# EAGLE design IOMOD-MCP23008-v1_0 (EAGLE 9.7.0)
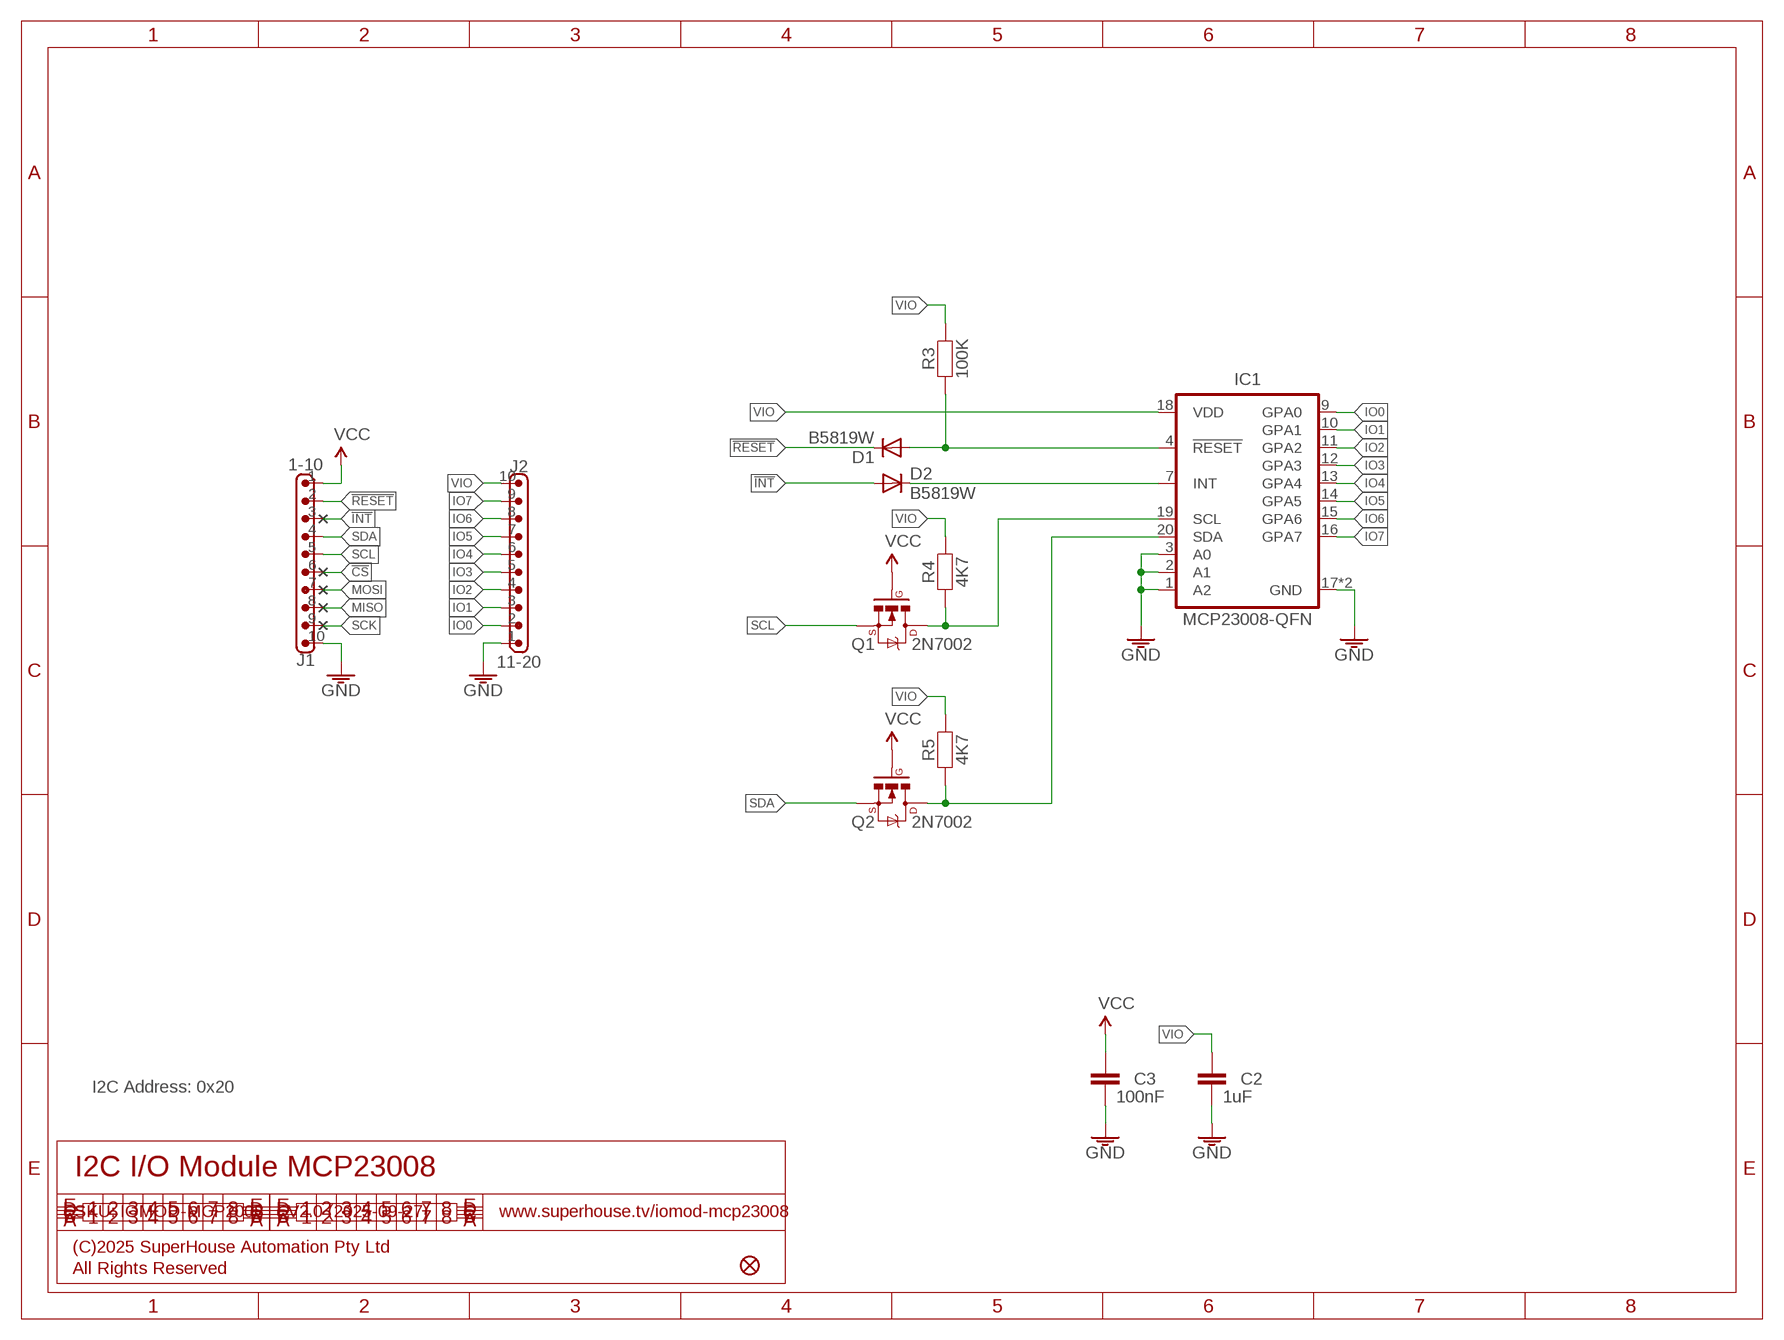
[diagram p0: schematic, sheet 1]

## Parts
C2  1uF  CAP0603  [C0603]
C3  100nF  CAP0603  [C0603]
D1  B5819W  DIODE-SOD123  [SOD-123]
D2  B5819W  DIODE-SOD123  [SOD-123]
FID1  FIDUCIAL1X2  [FIDUCIAL-1X2]
IC1  MCP23008-QFN  [QFN-20]
J1  1-10  M10-2.00-P-ABOVE  [1X10-2.00-P-ABOVE]
J2  11-20  M10-2.00-P-ABOVE  [1X10-2.00-P-ABOVE]
Q1  2N7002  MOSFET-NCHANNEL-233  [SOT23-3]
Q2  2N7002  MOSFET-NCHANNEL-233  [SOT23-3]
R3  100K  RESISTOR0603  [R0603]
R4  4K7  RESISTOR0603  [R0603]
R5  4K7  RESISTOR0603  [R0603]

## Nets
!CS: J1.6
!INT: D2.2(A) J1.3
!RESET: D1.1(C) J1.2
GND: C2.2 C3.2 IC1.1(A2) IC1.2(A1) IC1.3(A0) IC1.17(GND) IC1.TGND(GND) J1.10 J2.1
IO0: IC1.9(GPA0) J2.2
IO1: IC1.10(GPA1) J2.3
IO2: IC1.11(GPA2) J2.4
IO3: IC1.12(GPA3) J2.5
IO4: IC1.13(GPA4) J2.6
IO5: IC1.14(GPA5) J2.7
IO6: IC1.15(GPA6) J2.8
IO7: IC1.16(GPA7) J2.9
MISO: J1.8
MOSI: J1.7
N$2: IC1.20(SDA) Q2.3(D) R5.1
N$4: IC1.19(SCL) Q1.3(D) R4.1
N$11: D2.1(C) IC1.7(INT)
N$12: D1.2(A) IC1.4(!RESET) R3.1
SCK: J1.9
SCL: J1.5 Q1.2(S)
SDA: J1.4 Q2.2(S)
VCC: C3.1 J1.1 Q1.1(G) Q2.1(G)
VIO: C2.1 IC1.18(VDD) J2.10 R3.2 R4.2 R5.2

## Notes on the sheet
- I2C Address: 0x20
- I2C I/O Module MCP23008
- SKU: IOMOD-MCP2008 | V2.0 (2025-09-27) | www.superhouse.tv/iomod-mcp23008
- (C)2025 SuperHouse Automation Pty Ltd
- All Rights Reserved

## Library data of the parts
C2 C3 = SuperHouse-Capacitors:CAP: Capacitor Standard ceramic capacitor
D1 D2 = SuperHouse-Diodes:DIODE: Diode Standard reverse protection diodes and small signal diodes. SMA package can handle up to about 1A. SOD-323 can handle about 200mA.
FID1 = SuperHouse-Symbols:FIDUCIAL: Fiducial Alignment Points Various fiducial points for machine vision alignment.
IC1 = SuperHouse-ICs:MCP23008
J1 J2 = SuperHouse-Connectors:M10: 10-way header Standard 1x10 header, and screw terminal variations
Q1 Q2 = SuperHouse-Transistors:MOSFET-NCHANNEL: N-channel MOSFET
R3-R5 = SuperHouse-Resistors:RESISTOR: Resistors in both surface-mount and through-hole versions.

## Net classes
0 Default: width 0.203 mm
1 VCC: width 0.305 mm

## Board
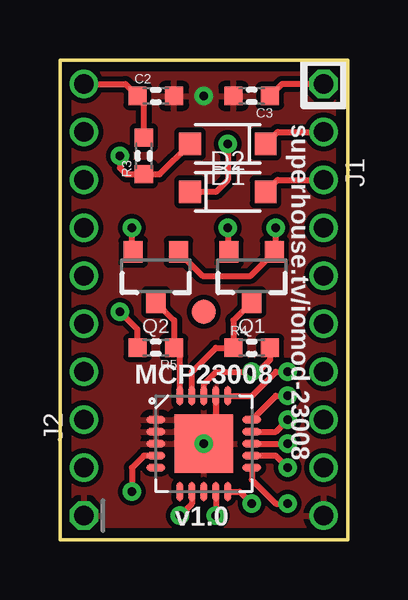
[diagram p1: board, top side]
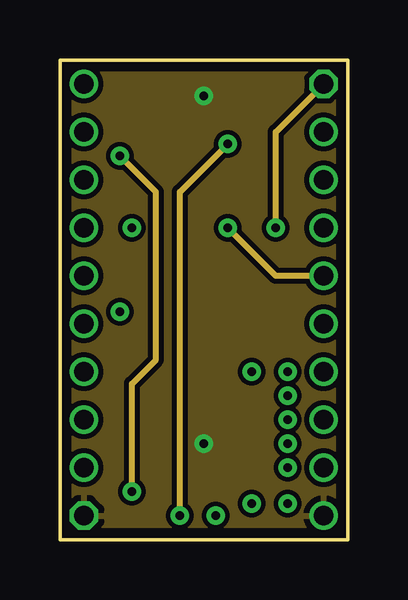
[diagram p2: board, inner layer Route2]
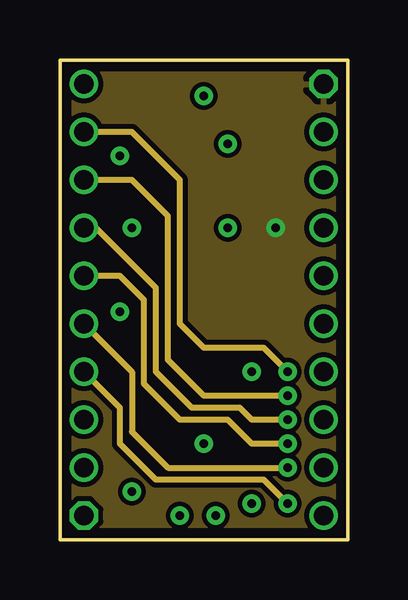
[diagram p3: board, inner layer Route15]
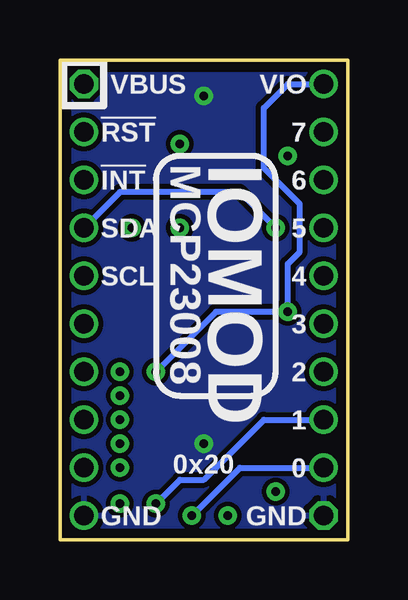
[diagram p4: board, bottom side, seen from below]

Size 12 x 20 mm. Coordinates in mm from the lower left corner, seen from the top.
Outline: 12,0 0,0 0,20 12,20 12,0
Copper layers (1+2*15+16): Top 0.035mm / dielectric 1.5mm / Route2 0.035mm / dielectric 0.15mm / Route15 0.035mm / dielectric 0.2mm / Bottom 0.035mm
Design rules "SuperHouse-Design-Rules *": minimum track width 10mil, minimum drill 24mil, track to track 8mil, track to pad 8mil, pad to pad 8mil, via to via 8mil, smd to smd 6mil, copper to edge 0.4mm, drill to drill 8mil, minimum pad ring 7mil, minimum via ring 8mil, stop-mask expansion 4mil, vias tented up to drill 0.5mm, thermal gap 10mil

### Footprints (pad centres in the part's own frame; a part is rotated, then mirrored left to right if it is on the bottom)
C0603 = smd 0.762 x 0.762: 1 -0.762,0; 2 0.762,0
SOD-123 = smd 0.9 x 0.95: 1 -1.575,0; 2 1.575,0
FIDUCIAL-1X2 = smd 1 x 1: 1 0,0
QFN-20 = smd 0.8 x 0.3: 1 -2,1; 2 -2,0.5; 3 -2,0; 4 -2,-0.5; 5 -2,-1; 11 2,-1; 12 2,-0.5; 13 2,0; 14 2,0.5; 15 2,1 | smd 0.3 x 0.8: 6 -1,-2; 7 -0.5,-2; 8 0,-2; 9 0.5,-2; 10 1,-2; 16 1,2; 17 0.5,2; 18 0,2; 19 -0.5,2; 20 -1,2 | smd 2.45 x 2.45: TGND 0,0
1X10-2.00-P-ABOVE = drill 0.8 octagon: 1 -9,0 | drill 0.8: 2 -7,0; 3 -5,0; 4 -3,0; 5 -1,0; 6 1,0; 7 3,0; 8 5,0; 9 7,0; 10 9,0
SOT23-3 = smd 0.8 x 0.9: 1 -0.95,-1; 2 0.95,-1; 3 0,1.1
R0603 = smd 0.762 x 0.762: 1 -0.762,0; 2 0.762,0

### Placement (x,y rotation side)
C2  4,18.5 0 top
C3  8,18.5 180 top
D1  7,16.5 180 top
D2  7,14.5 0 top
FID1  6,9.5 0 top
IC1  6,4 0 top
J1  11,10 270 top
J2  1,10 90 top
Q1  8,11 180 top
Q2  4,11 180 top
R3  3.5,16 90 top
R4  8,8 0 top
R5  4,8 180 top

### Tracks (layer width: path | path; a pad name or v marks a point on that pad's centre or on a via)
!INT
  Top 0.254: D2.2 9.07,15 J1.3
!RESET
  Top 0.254: D1.1 9.07,17 J1.2
GND  (via drill 0.35)
  Top 0.254: IC1.17 6.5,4.5 IC1.TGND
  other vias: 6,18.5 6,4
  pour Top: 0.04,0.04 11.96,0.04 11.96,19.96 0.04,19.96
  pour Bottom: 0.04,0.04 11.96,0.04 11.96,19.96 0.04,19.96
  pour Route2: 0.04,0.04 11.96,0.04 11.96,19.96 0.04,19.96
IO0  (via drill 0.35)
  Top 0.254: IC1.9 v6.5,1
  Bottom 0.254: v6.5,1 4.5,3 J2.2
IO1  (via drill 0.35)
  Top 0.254: IC1.10 7.5,2 v8,1.5
  Bottom 0.254: v8,1.5 7,2.5 6,2.5 3.5,5 J2.3
IO2  (via drill 0.35)
  Top 0.254: IC1.11 8,2.5 9,1.5 v9.5,1.5
  Route15 0.254: v9.5,1.5 8.5,2.5 4,2.5 2.5,4 2.5,5.5 J2.4
IO3  (via drill 0.35)
  Top 0.254: v9.5,3 9,3.5 IC1.12
  Route15 0.254: J2.5 3,7 3,4.5 4.5,3 v9.5,3
IO4  (via drill 0.35)
  Top 0.254: IC1.13 v9.5,4
  Route15 0.254: v9.5,4 IC1.13 7,5 5,5 3.5,6.5 3.5,10 2.5,11 J2.6
IO5  (via drill 0.35)
  Top 0.254: IC1.14 9,4.5 v9.5,5
  Route15 0.254: v9.5,5 8,5 7.5,5.5 5.5,5.5 4,7 4,10.5 1.5,13 J2.7
IO6  (via drill 0.35)
  Top 0.254: IC1.15 9,6 v9.5,6
  Route15 0.254: v9.5,6 6,6 4.5,7.5 4.5,13.5 3,15 J2.8
IO7  (via drill 0.35)
  Top 0.254: IC1.16 8,6 9,7 v9.5,7
  Route15 0.254: v9.5,7 8.5,8 6,8 5,9 5,15 3,17 J2.9
N$2
  Top 0.254: IC1.20 5,7.76 R5.1 4.76,9.14 Q2.3
N$4
  Top 0.254: Q1.3 7.24,9.14 R4.1 6.5,8 5.5,7 IC1.19
N$11  (via drill 0.35)
  Top 0.254: IC1.7 5.5,1.5 v5,1 | v7,16.5 7,15 6.5,14.5 D2.1
  Route2 0.254: v5,1 5,14.5 v7,16.5
N$12  (via drill 0.35)
  Top 0.254: D1.2 4.16,15.24 R3.1 2.76,15.24 2.5,15.5 v2.5,16 | IC1.4 3.5,3.5 3,3 v3,2
  Route2 0.254: v3,2 3,6.5 4,7.5 4,14.5 v2.5,16
SCL  (via drill 0.35)
  Top 0.254: v7,13 7,12.05 Q1.2
  Route2 0.254: J1.5 9,11 v7,13
SDA  (via drill 0.35)
  Top 0.254: Q2.2 3,12.05 v3,13
  Bottom 0.254: v3,13 4.5,14.5 9.5,14.5 J1.4
VCC  (via drill 0.35)
  Top 0.254: J1.1 9.26,19 C3.1 | Q2.1 5.95,11 7.95,11 Q1.1 9,12.05 v9,13
  Route2 0.254: v9,13 9,17 J1.1
  pour Route15: 0.04,0.04 11.96,0.04 11.96,19.96 0.04,19.96
VIO  (via drill 0.35)
  Top 0.254: R3.2 3.5,18.24 C2.1 2.74,19 J2.10 | IC1.18 6,6.5 6.5,7 v8,7 8.26,7 8.76,7.5 R4.2 | R5.2 3.24,8.76 v2.5,9.5
  Bottom 0.254: v8,7 5.5,9.5 v2.5,9.5 2.5,11.5 2,12 2,14 3.5,15.5 3.5,18 2.5,19 J2.10

### Text on the board
tPlace: superhouse.tv/iomod-23008 | MCP23008 | v1.0
bPlace: VIO | VBUS | 7 | !RST | IOMOD | MCP23008 | 6 | !INT | 5 | SDA | 4 | SCL | 3 | 2 | 1 | 0 | 0x20 | GND | GND